# EAGLE design RFstick (EAGLE 7.2.0)
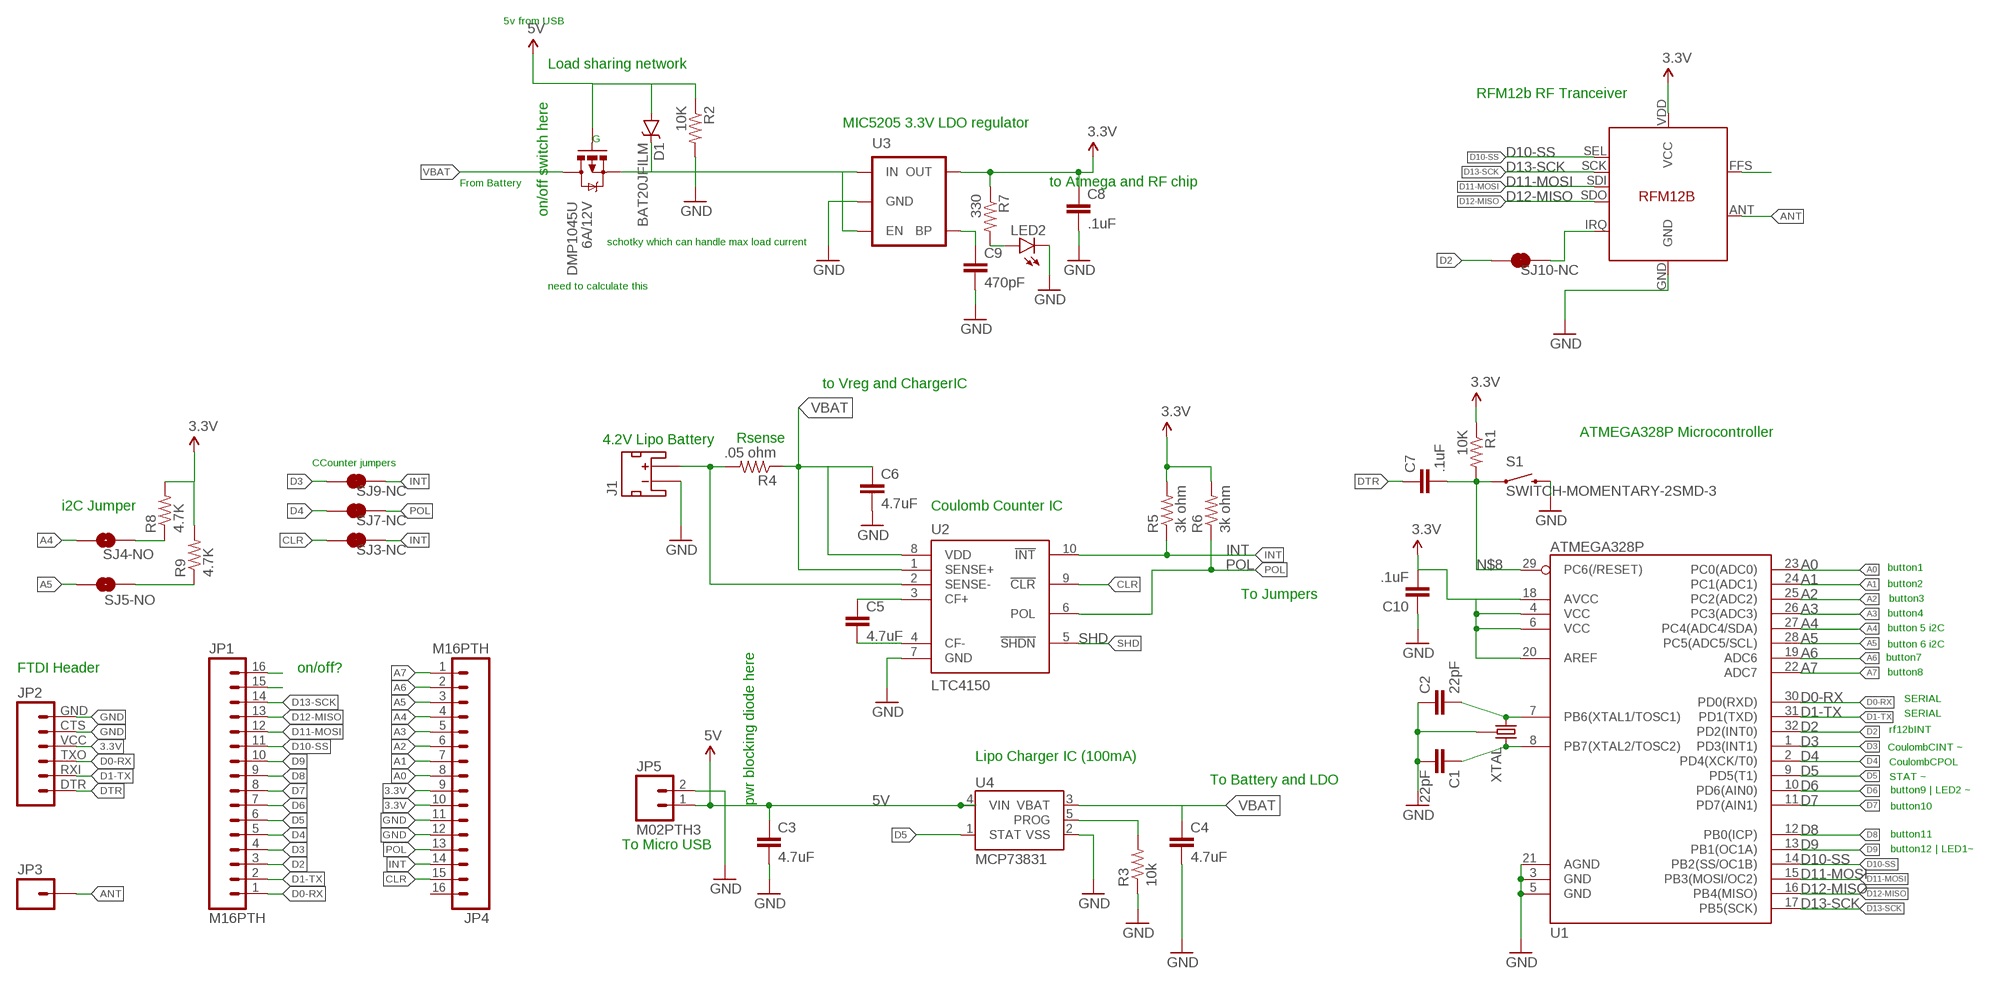
[diagram p0: schematic, sheet 1]

## Parts
C1  22pF  22PF-50V-5%(0603)  [0603-CAP]
C2  22pF  22PF-50V-5%(0603)  [0603-CAP]
C3  4.7uF  4.7UF-6.3V-10%(0603)0603  [0603-CAP]
C4  4.7uF  4.7UF-6.3V-10%(0603)0603  [0603-CAP]
C5  4.7uF  4.7UF-6.3V-10%(0603)0603  [0603-CAP]
C6  4.7uF  4.7UF-6.3V-10%(0603)0603  [0603-CAP]
C7  .1uF  22PF-50V-5%(0603)  [0603-CAP]
C8  .1uF  4.7UF-6.3V-10%(0603)0603  [0603-CAP]
C9  470pF  470PF-50V-5%(0603)SMD  [0603-CAP]
C10  .1uF  22PF-50V-5%(0603)  [0603-CAP]
D1  BAT20JFILM  [SOD-323]
DMP1045U  6A/12V  MOSFET-PCHANNELDMG2307L  [SOT23-3]
J1  JST_2MM_MALE  [JST-2-SMD]
JP1  M16PTH  [1X16]
JP2  M06SIP  [1X06]
JP3  M01PTH  [1X01]
JP4  M16PTH  [1X16]
JP5  M02PTH3  [1X02_LONGPADS]
LED2  LED0603  [LED-0603]
R1  10K  10KOHM1/10W1%(0603)0603  [0603-RES]
R2  10K  10KOHM1/10W1%(0603)0603  [0603-RES]
R3  10k  2.0KOHM1/10W5%(0603)  [0603-RES]
R4  .05 ohm  330OHM1/10W1%(0603)  [0603-RES]
R5  3k ohm  330OHM1/10W1%(0603)  [0603-RES]
R6  3k ohm  330OHM1/10W1%(0603)  [0603-RES]
R7  330  330OHM1/10W1%(0603)  [0603-RES]
R8  4.7K  4.7KOHM-1/10W-1%(0603)  [0603-RES]
R9  4.7K  4.7KOHM-1/10W-1%(0603)  [0603-RES]
S1  SWITCH-MOMENTARY-2SMD-3  [TACTILE_SWITCH_SMD-3]
SJ3-NC  JUMPER-PAD-2-NC_BY_TRACENO_SILK  [PAD-JUMPER-2-NC_BY_TRACE_NO_SILK]
SJ4-NO  JUMPER-PAD-2-NO  [PAD-JUMPER-2-NO_NO_SILK]
SJ5-NO  JUMPER-PAD-2-NO  [PAD-JUMPER-2-NO_NO_SILK]
SJ7-NC  JUMPER-PAD-2-NC_BY_TRACENO_SILK  [PAD-JUMPER-2-NC_BY_TRACE_NO_SILK]
SJ9-NC  JUMPER-PAD-2-NC_BY_TRACENO_SILK  [PAD-JUMPER-2-NC_BY_TRACE_NO_SILK]
SJ10-NC  JUMPER-PAD-2-NC_BY_TRACENO_SILK  [PAD-JUMPER-2-NC_BY_TRACE_NO_SILK]
U1  ATMEGA328P  ATMEGA328_SMT  [TQFP32-08]
U2  LTC4150  [MSOP10]
U3  MIC52053.3V  [SOT23-5]
U4  MCP73831  [SOT23-5]
U$1  XTAL  CRYSTAL-GROUNDED  [CRYSTAL-SMD-5X3]
U$2  RFM12B  [RFM12B]

## Nets
3.3V: C8.1 C10.2 JP2.VCC JP4.9 JP4.10 R1.1 R5.2 R6.2 R7.1 R8.2 R9.2 U1.4(VCC) U1.6(VCC) U1.18(AVCC) U1.20(AREF) U3.5(OUT) U$2.VDD(VCC)
5V: C3.1 D1.A DMP1045U.1(G) JP5.1 R2.1 U4.4(VIN)
A0: JP4.8 U1.23(PC0(ADC0))
A1: JP4.7 U1.24(PC1(ADC1))
A2: JP4.6 U1.25(PC2(ADC2))
A3: JP4.5 U1.26(PC3(ADC3))
A4: JP4.4 SJ4-NO.1 U1.27(PC4(ADC4/SDA))
A5: JP4.3 SJ5-NO.1 U1.28(PC5(ADC5/SCL))
A6: JP4.2 U1.19(ADC6)
A7: JP4.1 U1.22(ADC7)
ANT: JP3.1 U$2.ANT
CLR: JP4.15 SJ3-NC.1 U2.9(!CLR!)
D0-RX: JP1.1 JP2.TXO U1.30(PD0(RXD))
D1-TX: JP1.2 JP2.RXI U1.31(PD1(TXD))
D2: JP1.3 SJ10-NC.1 U1.32(PD2(INT0))
D3: JP1.4 SJ9-NC.1 U1.1(PD3(INT1))
D4: JP1.5 SJ7-NC.1 U1.2(PD4(XCK/T0))
D5: JP1.6 U1.9(PD5(T1)) U4.1(STAT)
D6: JP1.7 U1.10(PD6(AIN0))
D7: JP1.8 U1.11(PD7(AIN1))
D8: JP1.9 U1.12(PB0(ICP))
D9: JP1.10 U1.13(PB1(OC1A))
D10-SS: JP1.11 U1.14(PB2(SS/OC1B)) U$2.SEL
D11-MOSI: JP1.12 U1.15(PB3(MOSI/OC2)) U$2.SDI
D12-MISO: JP1.13 U1.16(PB4(MISO)) U$2.SDO
D13-SCK: JP1.14 U1.17(PB5(SCK)) U$2.SCK
DTR: C7.1 JP2.DTR
GND: C1.2 C2.1 C3.2 C4.2 C6.2 C8.2 C9.2 C10.1 J1.1(-) JP2.CTS JP2.GND JP4.11 JP4.12 JP5.2 LED2.C R2.2 R3.1 S1.4 U1.3(GND) U1.5(GND) U1.21(AGND) U2.7(GND) U3.2(GND) U4.2(VSS) U$1.2 U$1.4 U$2.GND
INT: JP4.14 R5.1 SJ3-NC.2 SJ9-NC.2 U2.10(!INT!)
N$2: C1.1 U1.8(PB7(XTAL2/TOSC2)) U$1.1
N$3: C2.2 U1.7(PB6(XTAL1/TOSC1)) U$1.3
N$5: R3.2 U4.5(PROG)
N$6: C5.1 U2.3(CF+)
N$7: LED2.A R7.2
N$8: C7.2 R1.2 S1.1 U1.29(PC6(/RESET))
N$9: C5.2 U2.4(CF-)
N$10: JP1.16
N$11: J1.2(+) R4.2 U2.2(SENSE-)
N$12: JP1.15
N$13: C9.1 U3.4(BP)
N$14: U$2.FFS
N$15: R8.1 SJ4-NO.2
N$16: R9.1 SJ5-NO.2
N$17: D1.C DMP1045U.2(S) U3.1(IN) U3.3(EN)
N$19: SJ10-NC.2 U$2.IRQ
POL: JP4.13 R6.1 SJ7-NC.2 U2.6(POL)
SHD: U2.5(!SHDN!)
VBAT: C4.1 C6.1 DMP1045U.3(D) R4.1 U2.1(SENSE+) U2.8(VDD) U4.3(VBAT)
Unconnected: J1.NC1(PAD1) J1.NC2(PAD2) JP4.16

## Notes on the sheet
- 5v from USB
- Load sharing network
- RFM12b RF Tranceiver
- MIC5205 3.3V LDO regulator
- G
- From Battery | to Atmega and RF chip
- on/off switch here
- schotky which can handle max load current
- need to calculate this
- to Vreg and ChargerIC
- ATMEGA328P Microcontroller
- 4.2V Lipo Battery | Rsense
- CCounter jumpers
- i2C Jumper | Coulomb Counter IC
- button1
- button2
- To Jumpers
- button3
- button4
- button 5 i2C
- button 6 i2C
- button7
- FTDI Header | on/off? | button8
- SERIAL
- SERIAL
- rf12bINT
- CoulombCINT ~
- Lipo Charger IC (100mA)
- CoulombCPOL
- STAT ~
- To Battery and LDO
- button9 | LED2 ~
- pwr blocking diode here
- button10
- button11
- To Micro USB
- button12 | LED1~

## Library data of the parts
C1 C2 = SparkFun-Capacitors:22PF-50V-5%(0603): CAP-07876; MPN: 04025A220JAT2A; OC_NEWARK: 96M1143; PROD_ID: CAP-07876
C3-C6 = SparkFun-Capacitors:4.7UF-6.3V-10%(0603): CAP-08280; MPN: F981A475MMA; OC_NEWARK: 84R8922; PROD_ID: CAP-08280
C7 C10 = SparkFun-Capacitors:22PF-50V-5%(0603): CAP-07876; MPN: MC0603B104M500CT; OC_NEWARK: 06R4931; PROD_ID: CAP-07876; VALUE: 22pF
C8 = SparkFun-Capacitors:4.7UF-6.3V-10%(0603): CAP-08280; MPN: MC0603B104M500CT; OC_NEWARK: 06R4931; PROD_ID: CAP-08280; VALUE: 4.7uF
C9 = SparkFun-Capacitors:470PF-50V-5%(0603): CAP-07884; MPN: 06031C471JAT2A; OC_NEWARK: 96M1252; PROD_ID: CAP-07884
D1 = SparkFun-DiscreteSemi:BAT20JFILM: 23V, 1A Schottky diode, SOD-323 package; PROD_ID: DIO-11623
DMP1045U = SparkFun-DiscreteSemi:MOSFET-PCHANNEL: Generic PMOSFET IRLML2244 - TRANS-11153 (SOT-23 -20V -4.3A) (1.Gate 2.Source 3.Drain) FQP27P06 - COM-10349 <http://www.sparkfun.com/products/10349> (TO-220 -60V -27A) (1.Gate 2.Source 3.Drain); PROD_ID: TRANS-11308; VALUE: 2.5A/30V
J1 = SparkFun-Connectors:JST_2MM_MALE: Mates to single-cell LiPo batteries. CONN-08352; OC_NEWARK: unknown; PROD_ID: CONN-08352
JP1 JP4 = SparkFun-Connectors:M16: 1x16 .1" header; OC_NEWARK: unknown
JP2 = SparkFun-Connectors:M06: Header 6 Standard 6-pin 0.1" header. Use with straight break away headers (SKU : PRT-00116), right angle break away headers (PRT-00553), swiss pins (PRT-00743), machine pins (PRT-00117), and female headers (PRT-00115). Molex polarized connector foot print use with SKU : PRT-08094 with associated crimp pins and housings. NOTES ON THE VARIANTS LOCK and LOCK_LONGPADS... This footprint was designed to help hold the alignment of a through-hole component (i.e. 6-pin header) while soldering it into place. You may notice that each hole has been shifted either up or down by 0.005 of an inch from it's more standard position (which is a perfectly straight line). This slight alteration caused the pins (the squares in the middle) to touch the edges of the holes. Because they are alternating, it causes a "brace" to hold the component in place. 0.005 has proven to be the perfect amount of "off-center" position when using our standard breakaway headers. Although looks a little odd when you look at the bare footprint, once you have a header in there, the alteration is very hard to notice. Also,if you push a header all the way into place, it is covered up entirely on the bottom side. This idea of altering the position of holes to aid alignment will be further integrated into the Sparkfun Library for other footprints. It can help hold any component with 3 or more connection pins.; OC_NEWARK: unknown
JP3 = SparkFun-Connectors:M01: Header 1 Standard 1-pin 0.1" header. Use with straight break away headers (SKU : PRT-00116), right angle break away headers (PRT-00553), swiss pins (PRT-00743), machine pins (PRT-00117), and female headers (PRT-00115).
JP5 = SparkFun-Connectors:M02: Standard 2-pin 0.1" header. Use with - straight break away headers ( PRT-00116) - right angle break away headers (PRT-00553) - swiss pins (PRT-00743) - machine pins (PRT-00117) - female headers (PRT-00115) Molex polarized connector foot print use with: PRT-08233 with associated crimp pins and housings. 2.54_SCREWTERM for use with PRT-10571. 3.5mm Screw Terminal footprints for PRT-08084 5mm Screw Terminal footprints for use with PRT-08432; OC_NEWARK: unknown
LED2 = SparkFun-LED:LED: LEDs Standard schematic elements and footprints for 5mm, 3mm, 1206, and 0603 sized LEDs. 5mm - Spark Fun Electronics SKU : COM-00529 (and others); MPN: 150060RS75000; OC_NEWARK: 95W3795
R1 R2 = SparkFun-Resistors:10KOHM1/10W1%(0603): RES-00824; MPN: CRCW060310K0FKEAHP; OC_NEWARK: 68R2991; PROD_ID: RES-00824
R3 = SparkFun-Resistors:2.0KOHM1/10W5%(0603): RES-08296; MF: VISHAY/DALE; MPN: CRCW06032K00FKEA; OC_NEWARK: 52K8223; PROD_ID: RES-08296; VALUE: 2.0k
R4 = SparkFun-Resistors:330OHM1/10W1%(0603): RES-00818; MPN: MC0063W060311R0; OC_NEWARK: 94W5638; PROD_ID: RES-00818; VALUE: 330
R5 R6 = SparkFun-Resistors:330OHM1/10W1%(0603): RES-00818; MPN: SR1-0603-230; OC_NEWARK: 33C6462; PROD_ID: RES-00818; VALUE: 330
R7 = SparkFun-Resistors:330OHM1/10W1%(0603): RES-00818; OC_NEWARK: unknown; PROD_ID: RES-00818
R8 R9 = SparkFun-Resistors:4.7KOHM-1/10W-1%(0603): RES-07857; MF: VISHAY/DALE; MPN: CRCW06034K70FKEA; OC_NEWARK: 52K8494; PROD_ID: RES-07857
S1 = SparkFun-Electromechanical:SWITCH-MOMENTARY-2: Various NO switches- pushbuttons, reed, etc; OC_NEWARK: unknown
SJ3-NC SJ7-NC SJ9-NC SJ10-NC = SparkFun-Passives:JUMPER-PAD-2-NC_BY_TRACE
SJ4-NO SJ5-NO = SparkFun-Passives:JUMPER-PAD-2-NO
U1 = SparkFun-DigitalIC:ATMEGA328_SMT: 32-Pin Atmega328 part Commonly used on Arduino compatible boards Available in QFP and QFN packages TQFP is IC-09069 QFN is non-stock; OC_NEWARK: unknown; PROD_ID: IC-09069
U2 = SparkFun-DigitalIC:LTC4150: LTC4150 Coulomb Counter / Battery Gas Gauge * Indicates Charge Quantity and Polarity * ±50mV Sense Voltage Range * Precision Timer Capacitor or Crystal Not Required * 2.7V to 8.5V Operation * High Side Sense * 32.55Hz/V Charge Count Frequency * 1.5μA Shutdown Current * 10-Pin MSOP Package Manufacturer's page: http://www.linear.com/product/LTC4150; MPN: LTC4150CMS#PBF; OC_NEWARK: 56M8728
U3 = SparkFun-PowerIC:MIC5205: MIC5205 150mA vreg 3.3V - VREG-00822 5V - VREG-00823; MPN: MIC5205-3.3YM5 TR; OC_NEWARK: 26R6805; PROD_ID: VREG-00822
U4 = SparkFun-PowerIC:MCP73831: Miniature single cell, fully integrated Li-Ion, Li-polymer charge management controller http://ww1.microchip.com/downloads/en/DeviceDoc/21984a.pdf IC-09995; MPN: MCP73831T-2ACI/OT; OC_NEWARK: 56K7045; PROD_ID: IC-09995
U$1 = SparkFun-FreqCtrl:CRYSTAL-GROUNDED; MPN: AA-16.000MALE-T; OC_NEWARK: 05W6188
U$2 = JeeParts:RFM12B; OC_NEWARK: unknown

## Board
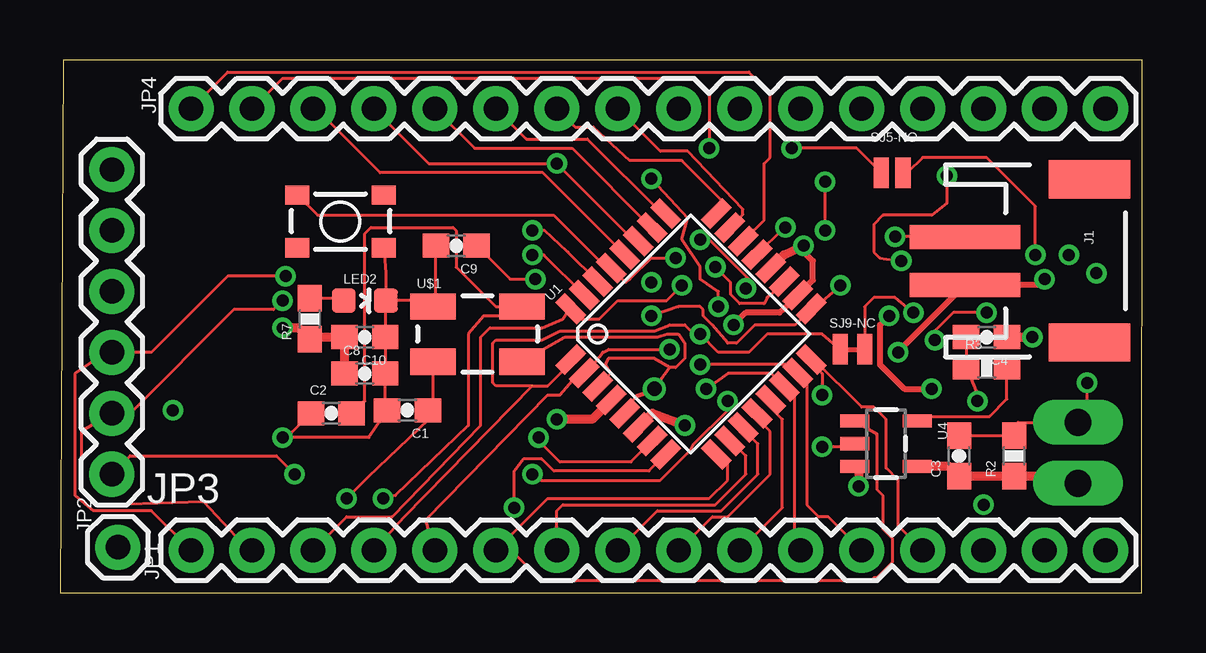
[diagram p1: board, top side]
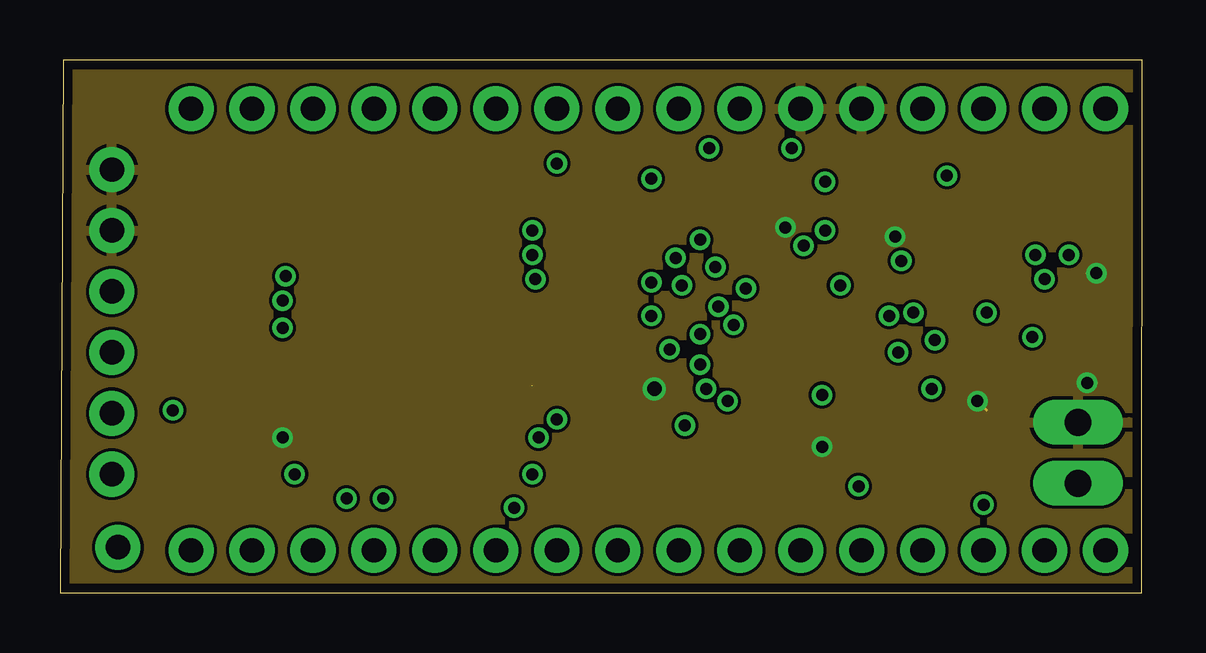
[diagram p2: board, inner layer GND]
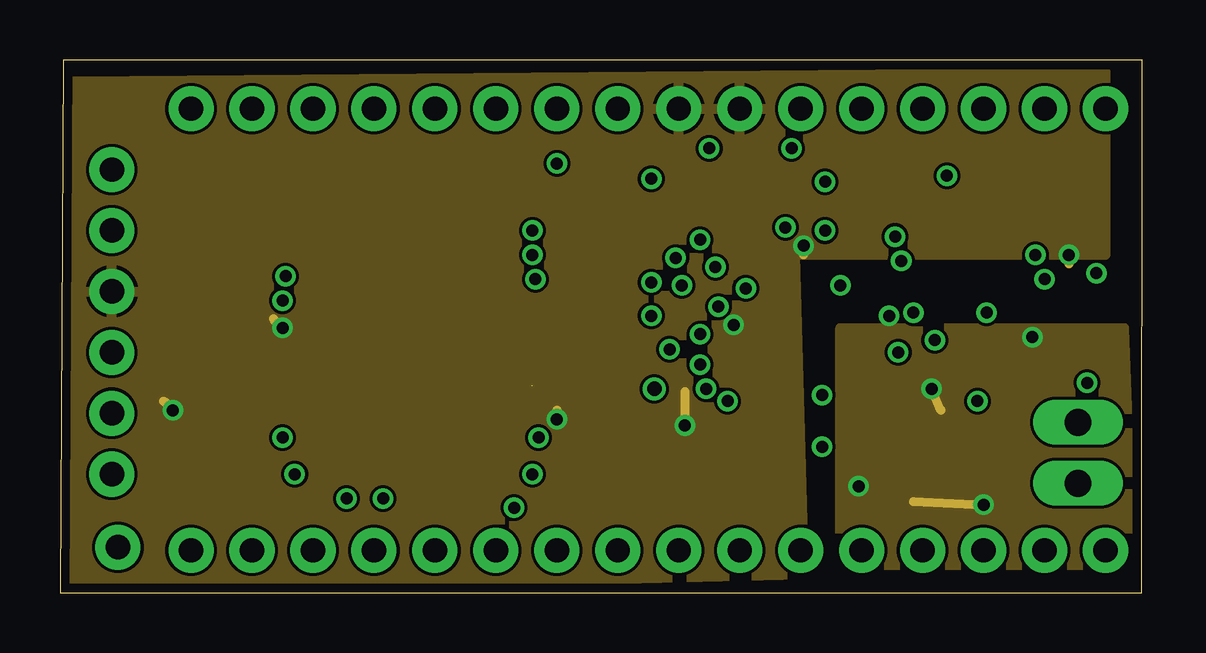
[diagram p3: board, inner layer 3.3V]
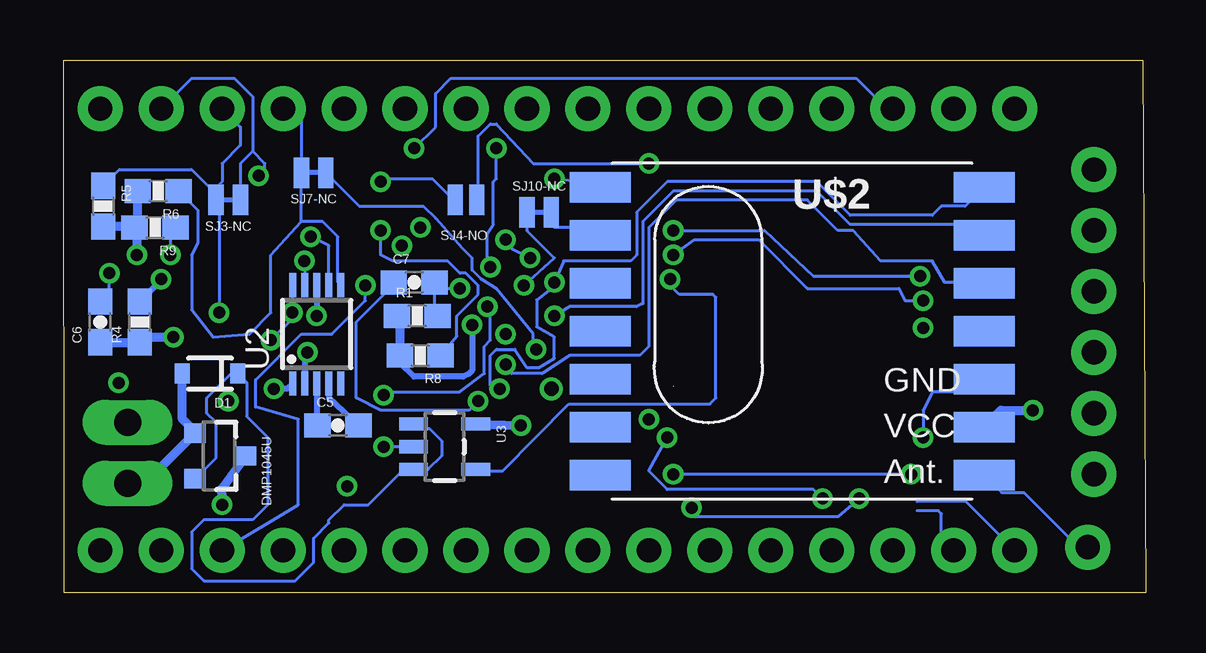
[diagram p4: board, bottom side, seen from below]

Size 45.09 x 22.22 mm. Coordinates in mm from the lower left corner, seen from the top.
Outline: 0,0 45.06,0 45.09,22.22 0.13,22.22 0,0
Copper layers (1*2*15*16): Top 0.0356mm / dielectric 1.5011mm / GND 0.0356mm / dielectric 0.1499mm / 3.3V 0.0356mm / dielectric 0.2007mm / Bottom 0.0356mm
Design rules "OSHpark4Layer": minimum track width 5mil, minimum drill 10mil, track to track 5mil, track to pad 5mil, pad to pad 5mil, via to via 5mil, smd to smd 0mil, copper to edge 15mil, drill to drill 6mil, minimum pad ring 4mil, minimum via ring 7mil, stop-mask expansion 3mil, vias tented up to drill 20mil, thermal gap 6mil

### Footprints (pad centres in the part's own frame; a part is rotated, then mirrored left to right if it is on the bottom)
0603-CAP = smd 1.1 x 1: 1 -0.85,0; 2 0.85,0
SOD-323 = smd 0.63 x 0.83: A 1.15,0; C -1.15,0
SOT23-3 = smd 0.8 x 0.9: 1 -0.95,-1; 2 0.95,-1; 3 0,1.1
JST-2-SMD = smd 1 x 4.6: 1 -1,-3.7; 2 1,-3.7 | smd 1.6 x 3.4: NC1 -3.4,1.5; NC2 3.4,1.5
1X16 = drill 1.016 pad 1.88: 1 0,0; 2 2.54,0; 3 5.08,0; 4 7.62,0; 5 10.16,0; 6 12.7,0; 7 15.24,0; 8 17.78,0; 9 20.32,0; 10 22.86,0; 11 25.4,0; 12 27.94,0; 13 30.48,0; 14 33.02,0; 15 35.56,0; 16 38.1,0
1X06 = drill 1.016 pad 1.88: CTS 10.16,0; DTR 0,0; GND 12.7,0; RXI 2.54,0; TXO 5.08,0; VCC 7.62,0
1X01 = drill 1.016 pad 1.88: 1 0,0
1X02_LONGPADS = drill 1.118 pad 1.88 long: 1 0,0; 2 2.54,0
LED-0603 = smd 1 x 1: A 0,-0.877; C 0,0.877
0603-RES = smd 1.1 x 1: 1 -0.85,0; 2 0.85,0
TACTILE_SWITCH_SMD-3 = smd 1 x 0.8: 1 -1.8,1.1; 2 1.8,1.1; 3 -1.8,-1.1; 4 1.8,-1.1
PAD-JUMPER-2-NC_BY_TRACE_NO_SILK = smd 0.635 x 1.27: 1 -0.508,0; 2 0.508,0
PAD-JUMPER-2-NO_NO_SILK = smd 0.635 x 1.27: 1 -0.45,0; 2 0.45,0
TQFP32-08 = smd 1.27 x 0.559: 1 -4.293,2.8; 2 -4.293,2; 3 -4.293,1.2; 4 -4.293,0.4; 5 -4.293,-0.4; 6 -4.293,-1.2; 7 -4.293,-2; 8 -4.293,-2.8; 17 4.293,-2.8; 18 4.293,-2; 19 4.293,-1.2; 20 4.293,-0.4; 21 4.293,0.4; 22 4.293,1.2; 23 4.293,2; 24 4.293,2.8 | smd 0.559 x 1.27: 9 -2.8,-4.293; 10 -2,-4.293; 11 -1.2,-4.293; 12 -0.4,-4.293; 13 0.4,-4.293; 14 1.2,-4.293; 15 2,-4.293; 16 2.8,-4.293; 25 2.8,4.293; 26 2,4.293; 27 1.2,4.293; 28 0.4,4.293; 29 -0.4,4.293; 30 -1.2,4.293; 31 -2,4.293; 32 -2.8,4.293
MSOP10 = smd 0.3 x 1: 1 -1,-2.05; 2 -0.5,-2.05; 3 0,-2.05; 4 0.5,-2.05; 5 1,-2.05; 6 1,2.05; 7 0.5,2.05; 8 0,2.05; 9 -0.5,2.05; 10 -1,2.05
SOT23-5 = smd 0.55 x 1.2: 1 -0.95,-1.3; 2 0,-1.3; 3 0.95,-1.3; 4 0.95,1.3; 5 -0.95,1.3
CRYSTAL-SMD-5X3 = smd 1.9 x 1.1: 1 -1.85,-1.15; 2 1.85,-1.15; 3 1.85,1.15; 4 -1.85,1.15
RFM12B = smd 2.54 x 1.27: ANT 8,-6; FFS -8,2; GND 8,-2; IRQ -8,4; P$8 -8,0; P$9 -8,-2; P$10 -8,-4; P$12 -8,-6; P$16 8,0; SCK 8,4; SDI 8,2; SDO -8,6; SEL 8,6; VDD 8,-4

### Placement (x,y rotation side)
C1  14.48,7.62 180 top
C2  11.3,7.49 0 top
C3  37.47,5.71 90 top
C4  38.61,10.67 180 top
C5  33.66,6.99 0 bottom
C6  43.56,11.3 90 bottom
C7  30.48,12.95 0 bottom
C8  12.7,9.14 0 top
C9  16.51,14.48 180 top
C10  12.7,10.67 180 top
D1  38.99,9.14 180 bottom
DMP1045U  38.61,5.71 270 bottom
J1  41.4,13.84 270 top
JP1  5.46,1.78 0 top
JP2  2.16,4.95 90 top
JP3  2.41,1.91 0 top
JP4  5.46,20.19 0 top
JP5  42.42,4.57 90 top
LED2  12.7,12.19 270 top
R1  30.35,11.56 0 bottom
R2  39.75,5.71 90 top
R3  38.61,9.4 0 top
R4  41.91,11.3 90 bottom
R5  43.43,16.13 270 bottom
R6  41.15,16.76 180 bottom
R7  10.41,11.43 90 top
R8  30.23,9.91 180 bottom
R9  41.28,15.24 180 bottom
S1  11.68,15.49 0 top
SJ3-NC  38.23,16.38 180 bottom
SJ4-NO  28.32,16.38 180 bottom
SJ5-NO  34.67,17.53 0 top
SJ7-NC  34.67,17.53 180 bottom
SJ9-NC  33.02,10.16 0 top
SJ10-NC  25.27,15.88 0 bottom
U1  26.29,10.79 45 top
U2  34.54,10.79 0 bottom
U3  29.21,6.1 270 bottom
U4  34.42,6.22 270 top
U$1  17.4,10.79 0 top
U$2  14.73,10.92 0 bottom

### Tracks (layer width: path | path; a pad name or v marks a point on that pad's centre or on a via)
3.3V  (via drill 0.5)
  Top 0.254: v30.99,14.48 30.99,14.22 31.37,13.84 31.37,13.05 U1.18 30.35,12.03 29.97,11.68 28.58,11.68 v28.07,11.18
  Top 0.381: v9.27,11.05 9.95,11.05 R7.1 10.5,10.67 C10.2 C8.1 | U1.6 24.68,7.49 v26.04,6.99 | U1.4 22.17,7.24 v20.7,7.24 | U1.20 30.16,14.1 v30.99,14.48
  3.3V 0.381: 8.89,11.43 v9.27,11.05 | 4.32,8 v4.7,7.62 | 26.04,8.38 v26.04,6.99 | 20.7,7.62 v20.7,7.24 | v30.99,14.48 30.99,14.1 | 42.04,13.72 v42.04,14.1
  Bottom 0.254: v28.07,11.18 28.07,9.27 28.19,9.14 28.45,9.02 30.48,9.02 31.08,9.61 R8.2
  Bottom 0.381: U$2.VDD 6.03,7.62 v4.7,7.62 | U3.5 26.07,6.99 v26.04,6.99 | R1.1 31.08,11.05 R8.2 | 42.04,15.33 R9.2 42.16,15.28 R5.2 | R6.2 42,15.37 42.04,15.33 | 42.04,15.33 v42.04,14.1
  pour 3.3V: 0.51,21.34 43.56,21.72 43.56,14.1 30.61,14.1 30.99,0.76 0.51,0
5V
  Top 0.381: JP5.1 42.12,4.86 R2.1 | R2.1 C3.1 37.06,5.27 U4.4 | R2.1 39.75,4.95
  Bottom 0.381: JP5.1 41.7,4.57 DMP1045U.1 39.75,6.81 39.75,6.86 40.14,7.25 D1.A
A0
  Top 0.127: JP4.8 25.02,18.42 26.16,18.42 28.45,16 28.45,15.78 U1.23
A1
  Top 0.127: JP4.7 21.46,19.43 22.23,19.43 23.75,18.03 25.91,18.03 27.56,16.38 27.56,16.03 U1.24
A2
  Top 0.127: JP4.6 19.43,18.92 21.97,18.92 25.08,15.81 U1.25
A3
  Top 0.127: JP4.5 17.27,18.54 21.34,18.54 24.63,15.25 U1.26
A4  (via drill 0.5)
  Top 0.127: JP4.4 15.37,17.91 v20.7,17.91 23.93,14.68 U1.27 24.13,14.71 24.13,14.73
  Bottom 0.127: SJ4-NO.1 27.81,16.44 27.81,19.05 27.3,19.56 27.05,19.56 25.53,17.91 v20.7,17.91
A5  (via drill 0.5)
  Top 0.127: U1.28 20.12,17.53 13.34,17.53 10.67,20.19 JP4.3 | SJ5-NO.1 33.2,18.54 v30.48,18.54
  Bottom 0.127: v30.48,18.54 29.59,19.43 29.59,20.83 28.96,21.46 12.07,21.46 10.8,20.19 JP4.3
A6  (via drill 0.5)
  Top 0.127: JP4.2 9.27,21.46 26.42,21.46 27.05,20.83 v27.05,18.54 | 29.64,12.7 U1.19 30.23,12.93 30.23,12.83 30.1,12.83 30.23,12.95 29.46,12.32 29.34,12.07 28.32,12.07 27.94,12.45 27.94,12.95 v27.3,13.59
  Bottom 0.127: v27.3,13.59 27.43,13.97 27.43,14.99 27.18,15.37 27.18,17.14 27.05,17.27 v27.05,18.54
A7
  Top 0.127: JP4.1 6.98,21.72 28.7,21.72 29.59,20.83 29.59,18.16 29.34,17.91 29.34,15.54 U1.22
ANT
  Bottom 0.127: U$2.ANT 6,4.19 5.08,4.19 2.79,1.91 JP3.1
CLR  (via drill 0.5)
  Top 0.127: v36.96,17.4 36.96,16.26 36.32,15.75 34.29,15.75 33.91,15.37 33.91,14.22 34.16,13.97 v35.05,13.84
  Bottom 0.127: JP4.15 39.75,21.46 37.97,21.46 37.21,20.7 37.21,18.42 | 37.21,18.42 37.72,17.91 SJ3-NC.1 | v35.05,13.84 35.04,13.45 U2.9 | v36.96,17.4 36.7,17.65 36.7,17.91 37.21,18.42
D0-RX  (via drill 0.5)
  Top 0.127: JP1.1 3.81,3.43 1.4,3.43 0.64,4.06 0.64,9.14 1.91,10.03 JP2.TXO 3.81,10.03 6.98,13.21 v9.4,13.21 | U1.30 21.16,14.22 20.19,15.11 v19.69,15.11
  Bottom 0.127: JP1.1 7.49,3.81 9.53,3.81 | v19.69,15.11 15.88,15.11 13.84,13.21 v9.4,13.21
D1-TX  (via drill 0.5)
  Top 0.127: JP1.2 7.87,1.78 5.97,3.81 1.52,3.68 0.89,4.32 0.89,6.73 JP2.RXI 2.92,7.49 7.24,11.81 8.89,11.81 v9.27,12.19 | U1.31 20.16,14.1 v19.69,14.1
  Bottom 0.127: JP1.2 8.51,2.29 8.51,3.3 8.64,3.43 9.53,3.43 | v19.69,14.1 18.8,14.73 16.13,14.73 14.1,12.7 10.29,12.7 10.03,12.19 v9.27,12.19
D2  (via drill 0.5)
  Top 0.127: JP1.3 11.94,3.18 13.84,3.18 17.53,6.99 17.53,10.67 17.91,11.05 20.07,11.05 20.96,11.43 21.25,11.85 U1.32 21.69,11.43 22.48,11.43 23.24,12.19 25.27,12.19 v25.91,12.83
  Bottom 0.127: SJ10-NC.1 25.78,15.11 24.64,13.97 v25.91,12.83
D3  (via drill 0.5)  (1 unrouted)
  Top 0.127: JP1.4 13.21,1.91 14.35,3.18 19.69,8.64 20.32,8.64 21.27,9.59 U1.1 | SJ9-NC.1 31.75,10.79 29.46,10.79 28.7,10.03 27.43,10.03 v26.67,10.79 26.42,10.79 26.04,11.18 25.4,11.18 24.77,10.92 20.83,10.92 20.07,10.54 18.16,10.54 18.03,10.41 18.03,8.76 18.16,8.64 19.66,8.64
D4  (via drill 0.5)
  Top 0.127: JP1.5 15.24,3.05 20.32,8.25 20.83,8.25 21.62,9.17 U1.2 22.32,9.65 22.61,10.03 22.86,10.16 v25.4,10.16
  Bottom 0.127: v25.4,10.16 25.53,10.29 25.53,10.79 27.05,12.7 27.69,13.08 28.07,13.46 28.07,13.97 28.45,14.35 29.59,15.62 30.1,16.13 32.77,16.13 SJ7-NC.1
D5
  Top 0.127: 27.3,5.71 27.3,5.74 U1.9 27.49,5.78 27.81,5.46 27.81,4.7 27.05,3.94 20.32,3.94 JP1.6 18.8,1.78 20.07,0.51 33.78,0.51 33.91,0.64 34.04,0.64 34.67,1.27 34.67,2.29 34.29,2.67 34.29,4.06 34.04,4.32 34.04,6.64 U4.1
D6
  Top 0.127: JP1.7 20.7,3.43 20.96,3.68 27.3,3.68 28.58,4.95 28.58,5.71 27.95,6.35 U1.10
D7
  Top 0.127: JP1.8 24.89,3.43 27.56,3.43 29.08,4.95 29.08,6.22 28.48,6.83 U1.11 28.55,6.99 28.58,6.99
D8
  Top 0.127: JP1.9 27.18,3.18 27.81,3.18 29.59,4.95 29.59,6.73 29.04,7.28 U1.12
D9
  Top 0.127: JP1.10 30.1,3.56 30.1,7.24 29.61,7.73 U1.13
D10-SS  (via drill 0.5)
  Top 0.127: JP1.11 30.61,2.03 30.61,8.25 30.25,8.61 U1.14 29.64,9.14 27.81,9.14 v26.92,8.51
  Bottom 0.127: U$2.SEL 7.53,16.13 8.51,16.13 8.89,15.75 12.32,15.75 13.72,17.14 19.94,17.14 21.21,15.88 21.21,14.1 21.46,13.84 24.26,13.84 v24.64,12.95 24.77,12.7 25.38,12.22 25.38,11.1 24.64,10.67 24.64,9.78 25.27,9.4 25.78,9.4 26.29,10.16 27.05,10.16 27.3,9.91 27.3,8.64 v26.92,8.51
D11-MOSI  (via drill 0.5)
  Top 0.127: JP1.12 32,3.18 31.62,3.18 31.12,3.68 31.12,8.8 U1.15 | U1.15 30.64,9.27 30.61,9.27 | U1.15 30.39,9.53 v26.67,9.53
  Bottom 0.127: U$2.SDI 6.76,12.95 8.38,12.95 8.89,13.84 11.05,13.84 12.19,15.11 12.83,15.11 14.1,16.38 19.56,16.38 20.7,15.24 20.7,10.29 21.08,9.91 24,9.91 25.15,9.14 26.42,9.14 v26.67,9.53
D12-MISO  (via drill 0.5)
  Top 0.127: JP1.13 34.92,2.79 34.92,4.7 34.42,5.21 34.42,7.24 33.91,7.75 33.4,7.75 31.41,9.74 U1.16 | 30.99,9.91 31.75,9.14 v31.75,8.25 | v24.64,17.27 26.16,15.62 25.91,14.73 26.67,13.59 26.67,13.08 27.43,12.57 v27.43,11.94
  Top 0.254: U1.16 31.27,9.78 31.24,9.78 31.12,9.91 30.99,9.91
  Bottom 0.127: v31.75,8.25 31.62,8.38 28.58,8.38 27.56,9.14 27.56,10.29 27.3,10.54 27.3,11.81 v27.43,11.94 | U$2.SDO 22.83,17.02 v24.64,17.27
D13-SCK  (via drill 0.5)
  Top 0.127: v32.51,12.83 31.41,11.85 U1.17 30.63,11.18 28.96,11.18 28.19,10.41 27.81,10.41 27.18,11.18 26.8,11.56 26.8,11.81 26.67,11.94 25.78,11.94 v24.64,11.56
  Bottom 0.127: JP1.14 35.31,3.68 35.31,7.24 37.08,7.75 37.08,8.89 35.18,10.79 33.91,10.79 32.51,12.19 v32.51,12.83 | U$2.SCK 7.18,15.37 12.32,15.37 13.72,16.76 19.69,16.76 20.96,15.49 20.96,12.07 21.21,11.94 24,11.94 v24.64,11.56
DTR  (via drill 0.5)
  Top 0.127: JP2.DTR 2.92,5.71 9.02,5.71 v9.78,4.95 | v19.69,4.95 20.07,4.7 25.02,4.7 26.29,5.97 26.42,6.22 27.81,7.62 v27.81,8
  Bottom 0.127: v9.78,4.95 v19.69,4.95 | v27.81,8 28.19,7.62 31.88,7.62 32.89,8.13 32.89,11.3 31.33,12.87 C7.1
GND  (via drill 0.5, 0.6)
  Top 0.127: U1.21 30.17,15.24 v30.23,15.24 | J1.1 37.69,14.86 v34.8,14.86 | C4.2 R3.1 38.23,8.29 v38.23,8 | v42.8,8.76 42.8,7.49 JP5.2 39.92,7.11 R2.2 C3.2 | 33.27,6.1 33.24,6.1 U4.2 32.99,6.1 v31.75,6.1 | U1.5 23.11,7.31 24.05,8.21 | U1.3 22.94,9.14 22.78,9.43 22.73,9.56 22.86,9.78 24.77,9.78 25.4,9.4 | LED2.C 13.58,13.34 S1.4 13.19,14.48 | LED2.C 13.55,12.17 C10.1 | C10.1 13.46,10.67 | C9.2 15.66,12.06 U$1.4 15.3,12.19 LED2.C | U$1.2 21.03,10.67 24.89,10.67 25.27,10.79 25.78,10.79 26.04,10.41 26.04,9.78 25.65,9.4 25.4,9.4 | C2.1 9.65,6.69 v9.27,6.48 12.87,6.48 C1.2 13.55,7.7 C8.2 C10.1 | 25.4,9.4 v24.77,8.51
  Top 0.178: 24.05,8.21 24.56,8.38 v24.77,8.51
  GND 0.127: 30.23,15.62 v30.23,15.24 | v34.8,14.86 34.42,14.86 | v42.8,8.76 43.18,8.76 | v38.23,8 38.61,7.62 | v43.18,13.33 42.8,13.33 | 31.75,6.48 v31.75,6.1 | v9.27,6.48 9.27,6.1
  Bottom 0.127: C6.2 43.18,12.53 v43.18,13.33 | U3.2 v31.75,6.1 | U2.7 34.04,14.48 v34.8,14.86 | U$2.GND 7.27,8.38 8.89,8.38 9.27,7.62 v9.27,6.48
  pour GND: 0.51,21.72 45.47,22.1 45.47,0.38 0.51,0
INT  (via drill 0.5)
  Top 0.127: v38.61,11.68 37.21,11.68 36.45,10.92 v36.45,10.54 | v35.56,11.68 34.8,12.32 33.91,12.32 33.53,11.94 SJ9-NC.2
  Bottom 0.127: JP4.14 37.72,19.43 37.72,18.67 38.48,17.91 38.48,17.14 38.73,16.89 SJ3-NC.2 | R5.1 42.76,17.65 39.75,17.65 38.86,16.76 SJ3-NC.2 | U2.10 35.56,12.83 35.56,11.43 | SJ3-NC.2 38.61,16.38 v38.61,11.68 | v36.45,10.54 35.56,11.43 | 35.56,11.43 35.43,11.56 v35.56,11.68
N$2  (via drill 0.5)
  Top 0.127: C1.1 15.55,7.84 | 15.55,7.84 U$1.1 | 15.55,7.84 14.88,7.24 15.37,7.24 12.83,4.83 v11.94,3.94 | U1.8 24.53,5.08 20.57,5.08 20.07,5.59 19.3,5.59 18.92,5.08 v18.92,3.56
  Bottom 0.127: v11.94,3.94 12.83,3.18 18.8,3.18 18.8,3.43 v18.92,3.56
N$3  (via drill 0.5)
  Top 0.127: C2.2 12.57,7.91 12.7,8 12.7,14.99 12.95,15.24 16.38,15.24 16.51,15.11 16.51,13.59 18.15,11.94 U$1.3 18.35,11.56 17.65,11.56 17.02,10.79 17.02,6.99 13.97,4.06 v13.46,3.94 | U1.7 23.78,5.46 20.83,5.46 20.07,6.22 v19.94,6.48
  Bottom 0.127: v13.46,3.94 13.84,4.32 19.94,4.32 20.7,5.08 v19.94,6.48
N$5
  Top 0.127: U4.5 35.91,7.37 38.73,7.37 39.46,8.09 R3.2
N$6
  Bottom 0.254: C5.1 U2.3
N$7
  Top 0.127: LED2.A 11.73,12.28 R7.2
N$8  (via drill 0.5)
  Top 0.127: S1.1 10.73,15.75 20.57,15.75 22.78,13.55 U1.29 23.56,12.95 23.75,13.08 24.64,13.97 v25.65,13.97 | v28.58,12.7 28.7,13.08 27.05,14.73 v26.67,14.73
  Bottom 0.127: R1.2 29.63,11.68 C7.2 29.38,12.7 v28.58,12.7 | v26.67,14.73 26.54,14.61 26.42,14.35 v25.65,13.97
N$9
  Bottom 0.254: U2.4 34.04,8.13 C5.2
N$11  (via drill 0.5)
  Top 0.254: v41.02,13.08 40.78,12.84 J1.2 34.92,10.07 v34.92,10.03
  Bottom 0.127: 41.02,13.04 v41.02,13.08
  Bottom 0.254: R4.2 41.02,13.04 | v34.92,10.03 35.04,9.91 U2.2
  Bottom 0.381: R4.2 42.04,12.28 42.04,12.19
N$13  (via drill 0.5)
  Top 0.127: C9.1 18.76,13.08 v19.81,13.08
  Bottom 0.127: v19.81,13.08 19.81,12.83 19.43,12.45 18.03,12.45 17.91,12.32 17.91,8.13 18.16,7.87 24.04,7.87 26.8,5.08 27.84,5.08 U3.4
N$15  (via drill 0.5)
  Top 0.127: v31.88,15.11 v31.88,17.14
  Bottom 0.127: R8.1 28.7,10.71 28.7,11.56 27.81,12.45 27.81,12.83 28.32,13.33 28.58,13.33 29.08,13.84 31.37,13.84 31.88,14.1 v31.88,15.11 | v31.88,17.14 32,17.27 29.72,17.27 28.83,16.38 SJ4-NO.2
N$16  (via drill 0.5)
  Top 0.127: v40.64,14.1 40.64,16.13 38.61,18.16 35.94,18.16 35.31,17.53 SJ5-NO.2
  Bottom 0.127: R9.1 40.64,15.03 v40.64,14.1
N$17
  Bottom 0.127: DMP1045U.2 38.73,5.64 38.73,7.11 39.12,7.49 39.12,8.13 38.1,9.14 D1.C 37.47,8.77 37.47,7.37 36.58,6.48 36.58,3.68 37.21,3.05 39.24,3.05 39.75,2.54 39.75,1.02 39.24,0.51 35.43,0.51 34.67,1.27 34.67,2.29 34.04,2.92 34.04,3.05 33.4,3.68 32.39,3.68 30.92,5.15 U3.3 29.91,5.15 29.34,5.71 29.34,6.35 29.84,6.86 30.32,6.86 U3.1
N$19
  Bottom 0.127: U$2.IRQ 23.05,15.24 24.64,15.24 24.77,15.37 SJ10-NC.2
POL
  Bottom 0.127: JP4.13 35.18,19.68 SJ7-NC.2 35.18,15.49 | U2.6 33.66,12.96 33.66,14.86 34.29,15.49 35.18,15.49 | R6.1 39.5,15.96 39.5,14.61 39.75,14.1 39.75,11.81 38.86,10.67 37.34,10.79 36.45,11.68 36.45,14.1 35.18,15.49
VBAT  (via drill 0.5)
  Top 0.254: v34.54,11.56 34.16,11.18 34.16,9.53 35.18,8.51 v36.32,8.51
  Top 0.381: U4.3 33.27,5.12 v33.27,4.44 | C4.1 v40.51,10.67
  3.3V 0.381: 36.7,7.62 v36.32,8.51 | 35.56,3.81 v38.48,3.68
  Bottom 0.254: U2.8 v34.54,11.56 | U2.1 35.78,8.51 v36.32,8.51
  Bottom 0.381: DMP1045U.3 38.52,4.32 v38.48,3.68 | C6.1 R4.1 41.7,10.67 v40.51,10.67
  pour 3.3V: 44.7,1.14 32.51,1.14 32.51,11.05 44.32,11.05